# EAGLE design RAMPSdisplay (EAGLE 6.2)
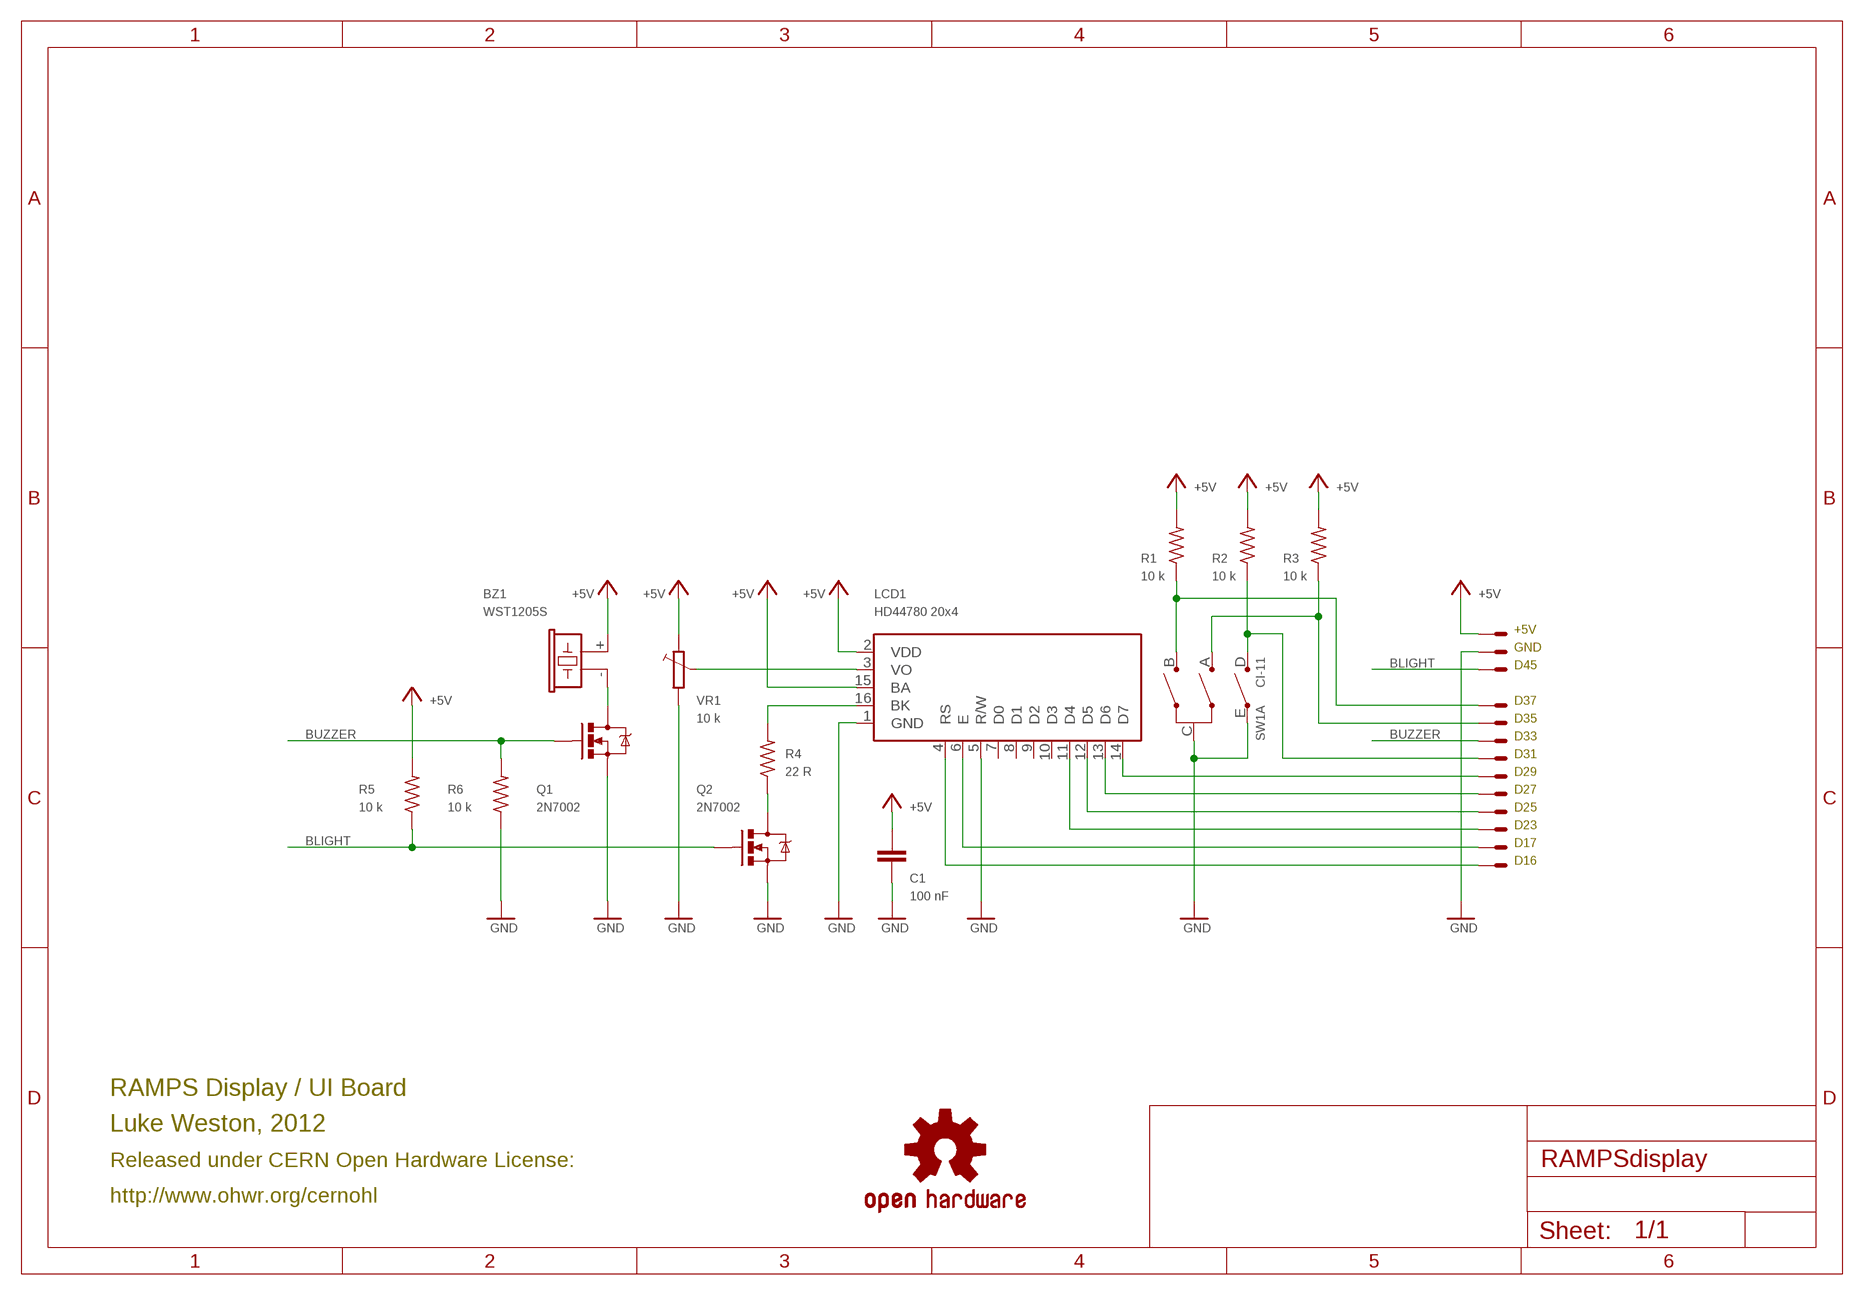
[diagram p0: schematic, sheet 1]

## Parts
BZ1  WST1205S  F/CM12P  [F/CM12P]
C1  100 nF  C-EUC0805K  [C0805K]
J1  22-05-7038-03  [7395-03]
J2  22-05-7108-10  [7395-10]
LCD1  HD44780 20x4  HDM20416L  [HDM20416L]
Q1  2N7002  MOSFET-NCHANNELSMD  [SOT23-3]
Q2  2N7002  MOSFET-NCHANNELSMD  [SOT23-3]
R1  10 k  R-US_M0805  [M0805]
R2  10 k  R-US_M0805  [M0805]
R3  10 k  R-US_M0805  [M0805]
R4  22 R  R-US_M0805  [M0805]
R5  10 k  R-US_M0805  [M0805]
R6  10 k  R-US_M0805  [M0805]
SW1  CI-11  [CI-11]
U$  OSHW-LOGOS  [OSHW-LOGO-S]
VR1  10 k  TRIM_EU-S64W  [S64W]

## Nets
+5V: BZ1.+ C1.1 J1.1 LCD1.2(VDD) LCD1.15(BA) R1.2 R2.2 R3.2 R5.2 VR1.E
BLIGHT: J1.3 Q2.1(G) R5.1
BUZZER: J2.3 Q1.1(G) R6.2
GND: C1.2 J1.2 LCD1.1(GND) LCD1.5(R/W) Q1.2(S) Q2.2(S) R6.1 SW1.C(A:C) SW1.E(B:E) VR1.A
N$2: LCD1.16(BK) R4.2
N$3: J2.4 R2.1 SW1.D(B:D)
N$4: J2.5 LCD1.14(D7)
N$5: J2.6 LCD1.13(D6)
N$6: J2.7 LCD1.12(D5)
N$7: J2.8 LCD1.11(D4)
N$8: J2.9 LCD1.6(E)
N$9: J2.10 LCD1.4(RS)
N$10: LCD1.3(VO) VR1.S
N$11: J2.2 R3.1 SW1.A(A:A)
N$12: J2.1 R1.1 SW1.B(A:B)
N$14: Q2.3(D) R4.1
N$16: BZ1.- Q1.3(D)
Unconnected: LCD1.7(D0) LCD1.8(D1) LCD1.9(D2) LCD1.10(D3)

## Notes on the sheet
- +5V
- GND
- D45
- D37
- D35
- D33
- D31
- D29
- D27
- D25
- D23
- D17
- D16
- RAMPS Display / UI Board
- Luke Weston, 2012
- Released under CERN Open Hardware License:
- http://www.ohwr.org/cernohl

## Library data of the parts
BZ1 = buzzer:F/CM12P: BUZZER Source: Buerklin; OC_FARNELL: unknown; OC_NEWARK: unknown
C1 = rcl:C-EU: CAPACITOR, European symbol
J1 = con-molex:22-?-03: CONNECTOR wire to board 2.54 mm (.1 inch) pitch header; OC_FARNELL: unknown; OC_NEWARK: unknown
J2 = con-molex:22-?-10: CONNECTOR wire to board 2.54 mm (.1 inch) pitch header; OC_FARNELL: unknown; OC_NEWARK: unknown
LCD1 = abi-lcd:HDM20416L
Q1 Q2 = freetronics-master-v1:MOSFET-NCHANNEL
R1-R6 = rcl:R-US_: RESISTOR, American symbol
SW1 = piher:CI-11: 11mm Incemental Encoder Source: www.piher.net .. 04-CI-11v04.pdf; OC_FARNELL: unknown; OC_NEWARK: unknown
U$ = SparkFun:OSHW-LOGO: Open Source Hardware Logo This logo indicates the piece of hardware it is found on incorporates a OSHW license and/or adheres to the definition of open source hardware found here: http://freedomdefined.org/OSHW
VR1 = pot:TRIM_EU-: POTENTIOMETER

## Net classes
0 default: width 0.152 mm, drill 0.241 mm, clearance 0.152 mm

## Board
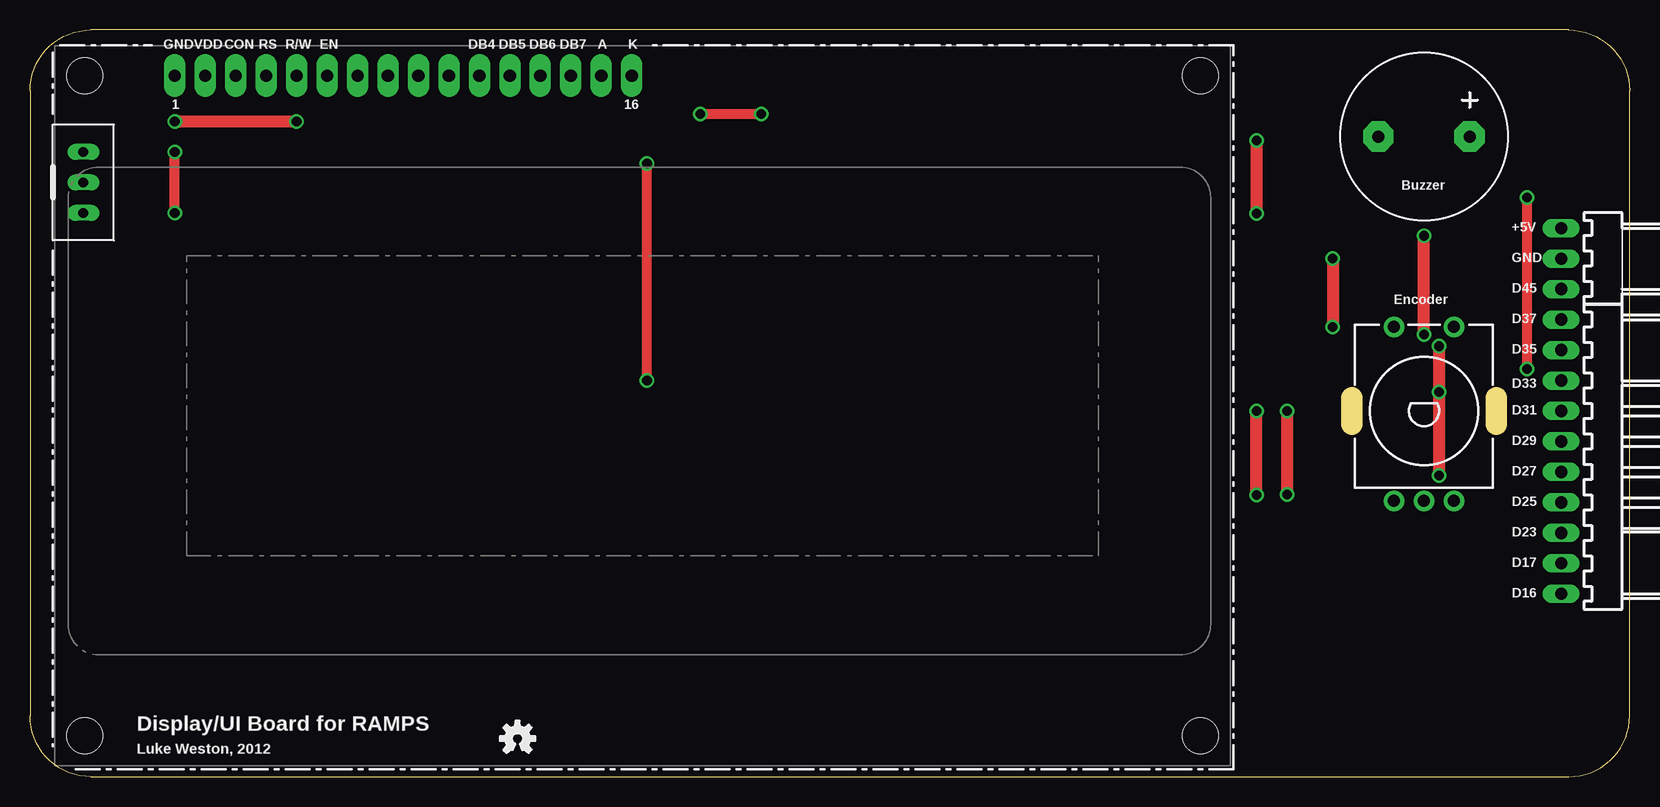
[diagram p1: board, top side]
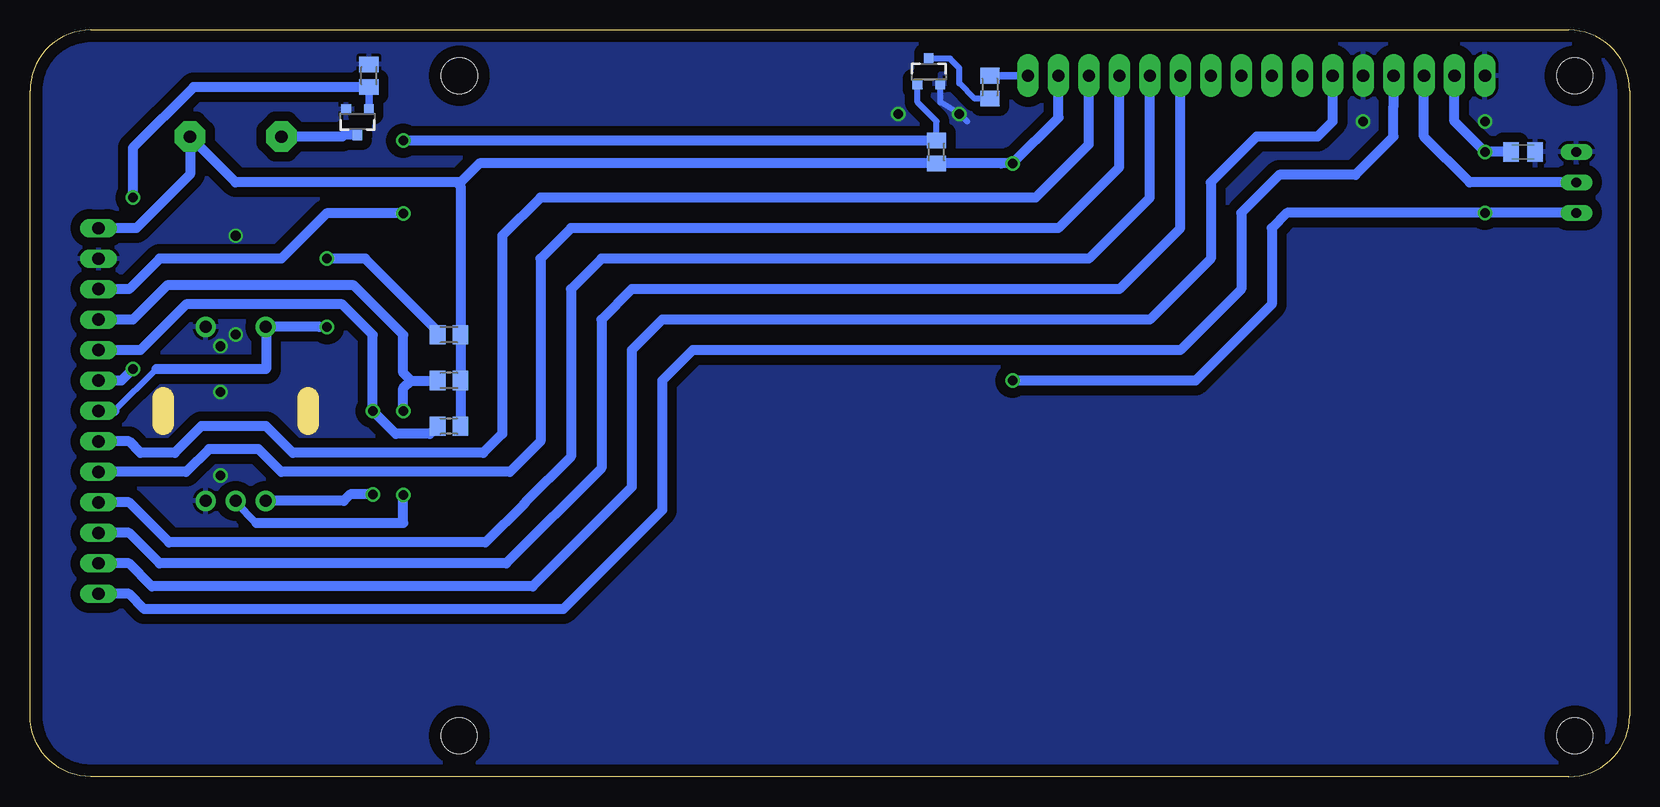
[diagram p2: board, bottom side, seen from below]

Size 133.35 x 62.23 mm. Coordinates in mm from the lower left corner, seen from the top.
Outline: 5.08,0 128.27,0 arc90 133.35,5.08 133.35,57.15 arc90 128.27,62.23 5.08,62.23 arc90 0,57.15 0,5.08 arc90 5.08,0
Copper layers (1*16): Top 0.035mm / dielectric 1.5mm / Bottom 0.035mm
Design rules: minimum track width 10mil, minimum drill 24mil, track to track 8mil, track to pad 8mil, pad to pad 8mil, via to via 8mil, smd to smd 8mil, copper to edge 40mil, drill to drill 8mil, minimum pad ring 10mil, minimum via ring 8mil, stop-mask expansion 4mil, vias tented up to drill 0mil, thermal gap 10mil

### Footprints (pad centres in the part's own frame; a part is rotated, then mirrored left to right if it is on the bottom)
F/CM12P = drill 1.016 pad 2.54 octagon: + 3.81,0; - -3.81,0
C0805K = smd 1.3 x 1.6: 1 -1,0; 2 1,0
7395-03 = drill 1.016 long: 1 2.54,0; 2 0,0; 3 -2.54,0
7395-10 = drill 1.016 long: 1 11.43,0; 2 8.89,0; 3 6.35,0; 4 3.81,0; 5 1.27,0; 6 -1.27,0; 7 -3.81,0; 8 -6.35,0; 9 -8.89,0; 10 -11.43,0
HDM20416L = drill 1.016 pad 1.778 long: 1 -38.105,27.947; 2 -35.565,27.947; 3 -33.025,27.947; 4 -30.485,27.947; 5 -27.945,27.947; 6 -25.405,27.947; 7 -22.865,27.947; 8 -20.325,27.947; 9 -17.785,27.947; 10 -15.245,27.947; 11 -12.705,27.947; 12 -10.165,27.947; 13 -7.625,27.947; 14 -5.085,27.947; 15 -2.545,27.947; 16 -0.005,27.947 | hole 3: -45.593,27.94; -45.593,-27.064; 47.409,-27.064; 47.396,27.94
SOT23-3 = smd 0.8 x 0.9: 1 -0.95,-1; 2 0.95,-1; 3 0,1.1
M0805 = smd 1.3 x 1.6: 1 -0.95,0; 2 0.95,0
CI-11 = drill 1 pad 1.676: A -2.5,-7.5; B 0,-7.5; C 2.5,-7.5; D -2.5,7; E 2.5,7
S64W = drill 0.813 long: A 2.54,1.27; E -2.54,1.27; S 0,1.27

### Placement (x,y rotation side)
BZ1  116.2,53.34 0 top
C1  8.89,52.07 0 bottom
J1  127.64,43.18 90 top
J2  127.64,26.67 90 top
LCD1  50.16,30.48 0 top
Q1  106.05,54.61 180 bottom
Q2  58.42,58.74 0 bottom
R1  98.42,33.02 0 bottom
R2  98.42,36.83 0 bottom
R3  98.42,29.21 0 bottom
R4  53.34,57.47 90 bottom
R5  57.79,52.07 270 bottom
R6  105.09,58.42 270 bottom
SW1  116.2,30.48 0 top
U$  40.64,3.17 0 top
VR1  5.71,49.53 90 top

### Tracks (layer width: path | path; a pad name or v marks a point on that pad's centre or on a via)
+5V  (via drill 0.8)
  Top 0.813: v51.44,33.02 v51.44,51.12 | v12.06,46.99 v12.06,52.07
  Bottom 0.813: J1.1 124.49,45.72 120.02,50.2 BZ1.+ 116.2,49.53 97.79,49.53 | VR1.E v12.06,46.99 28.57,46.99 29.84,45.72 29.84,39.37 36.2,33.02 v51.44,33.02 | LCD1.2 14.6,54.6 v12.06,52.07 C1.1 | LCD1.15 47.62,54.93 v51.44,51.12 52.39,51.12 R5.2 95.88,51.12 97.47,49.53 97.79,49.53 | R3.2 R1.2 R2.2 97.47,49.22 97.79,49.53
BLIGHT  (via drill 0.8)
  Top 1.016: v102.24,53.02 v102.24,46.95 v102.23,46.95
  Bottom 0.508: Q2.1 59.37,56.2 57.79,54.61 R5.1
  Bottom 0.813: R5.1 v102.24,53.02 | J1.3 125.09,40.64 122.55,43.18 112.39,43.18 108.62,46.95 v102.23,46.95
BUZZER  (via drill 0.8)
  Top 0.813: v124.78,48.26 v124.78,33.97
  Bottom 0.406: Q1.1
  Bottom 0.508: Q1.1 105.05,55.56
  Bottom 0.61: Q1.1 R6.2
  Bottom 0.813: J2.3 125.73,33.02 v124.78,33.97 | R6.2 119.72,57.47 124.78,52.41 v124.78,48.26
GND  (via drill 0.8)
  Top 0.813: v55.88,55.24 v60.96,55.24
  Top 1.016: v12.06,54.61 v22.22,54.61 | v117.47,25.11 v117.47,32.07 v117.47,35.88 | v116.2,36.86 v116.2,45.09
  Bottom 0.508: Q2.2 57.47,56.2 v55.88,55.24 55.25,54.61
  pour Bottom (isolate 0.813): 0,63.5 134.62,63.5 134.62,-1.27 0,-1.27
N$2
  Bottom 0.61: LCD1.16 53.33,58.43
  Bottom 0.813: 53.33,58.43 R4.2
N$3  (via drill 0.8)
  Top 1.016: v108.58,43.18 v108.58,37.47
  Bottom 0.483: 122.82,33.97 126.31,30.48
  Bottom 0.508: SW1.D 113.66,37.48
  Bottom 0.813: SW1.D 109.2,37.48 v108.58,37.47 | 113.66,37.48 113.66,33.97 122.82,33.97 | 126.31,30.48 J2.4 | R2.1 99.38,37.15 105.41,43.18 v108.58,43.18
N$4
  Bottom 0.406: LCD1.14
  Bottom 0.813: J2.5 125.09,27.94 124.14,26.99 121.28,26.99 119.06,29.21 113.66,29.21 111.44,26.99 95.57,26.99 93.98,28.57 93.98,45.09 90.8,48.26 49.53,48.26 45.09,52.7 LCD1.14
N$5
  Bottom 0.813: LCD1.13 42.54,50.8 47.62,45.72 88.27,45.72 90.8,43.18 90.8,27.94 93.34,25.4 112.39,25.4 114.3,27.3 118.43,27.3 120.33,25.4 J2.6
N$6
  Bottom 0.813: J2.7 125.09,22.86 121.76,19.53 95.38,19.53 92.18,22.73 92.07,22.86 88.27,26.67 88.27,40.64 85.72,43.18 45.09,43.18 40,48.27 LCD1.12
N$7
  Bottom 0.813: J2.8 125.09,20.32 122.55,17.78 93.66,17.78 85.72,25.72 85.72,38.1 83.18,40.64 42.55,40.64 37.46,45.73 LCD1.11
N$8
  Bottom 0.813: J2.9 125.09,17.78 123.19,15.88 91.44,15.88 83.18,24.13 83.18,35.56 80.64,38.1 40.01,38.1 34.93,43.18 34.93,49.53 31.11,53.34 26.04,53.34 24.76,54.62 LCD1.6
N$9
  Bottom 0.406: 19.68,55.88
  Bottom 0.61: 19.68,55.88 19.68,57.15
  Bottom 0.813: 19.68,55.88 LCD1.4 | J2.10 125.09,15.24 123.82,13.97 88.9,13.97 80.64,22.23 80.64,33.02 78.1,35.56 37.47,35.56 32.39,40.64 32.39,46.99 29.21,50.16 22.86,50.16 19.68,53.34 19.68,55.88
N$10
  Bottom 0.406: LCD1.3
  Bottom 0.813: LCD1.3 17.14,53.34 13.34,49.53 VR1.S
N$11  (via drill 0.8)
  Top 1.016: v104.77,30.48 v104.77,23.53
  Bottom 0.813: J2.2 124.14,35.56 120.33,39.37 107.31,39.37 104.77,36.83 v104.77,30.48 102.87,28.57 100.01,28.57 R3.1 | v104.77,23.53 106.65,23.53 107.19,22.98 SW1.A
N$12  (via drill 0.8)
  Top 1.016: v102.23,23.5 v102.23,30.48
  Bottom 0.406: 116.2,22.86 SW1.B
  Bottom 0.61: 114.48,21.14 116.2,22.86
  Bottom 0.813: J2.1 124.78,38.1 121.92,40.96 106.36,40.96 102.23,36.83 102.23,33.66 101.6,33.02 | v102.23,30.48 102.23,32.38 101.6,33.02 | v102.23,23.5 102.23,21.14 114.48,21.14 | 101.6,33.02 R1.1
N$14
  Bottom 0.508: R4.1 54.61,56.52 55.88,57.78 55.88,59.05 56.66,59.84 Q2.3
N$16
  Bottom 0.813: Q1.3 107.14,53.51 107.31,53.34 BZ1.-

### Text on the board
tPlace: GND | VDD | CON | RS | R/W | EN | DB4 | DB5 | DB6 | DB7 | A | K | Buzzer | +5V | GND | D45 | Encoder | D37 | D35 | D33 | D31 | D29 | D27 | D25 | D23 | D17 | D16 | Display/UI Board for RAMPS | Luke Weston, 2012